# EAGLE design driver_1 (EAGLE 7.2.0)
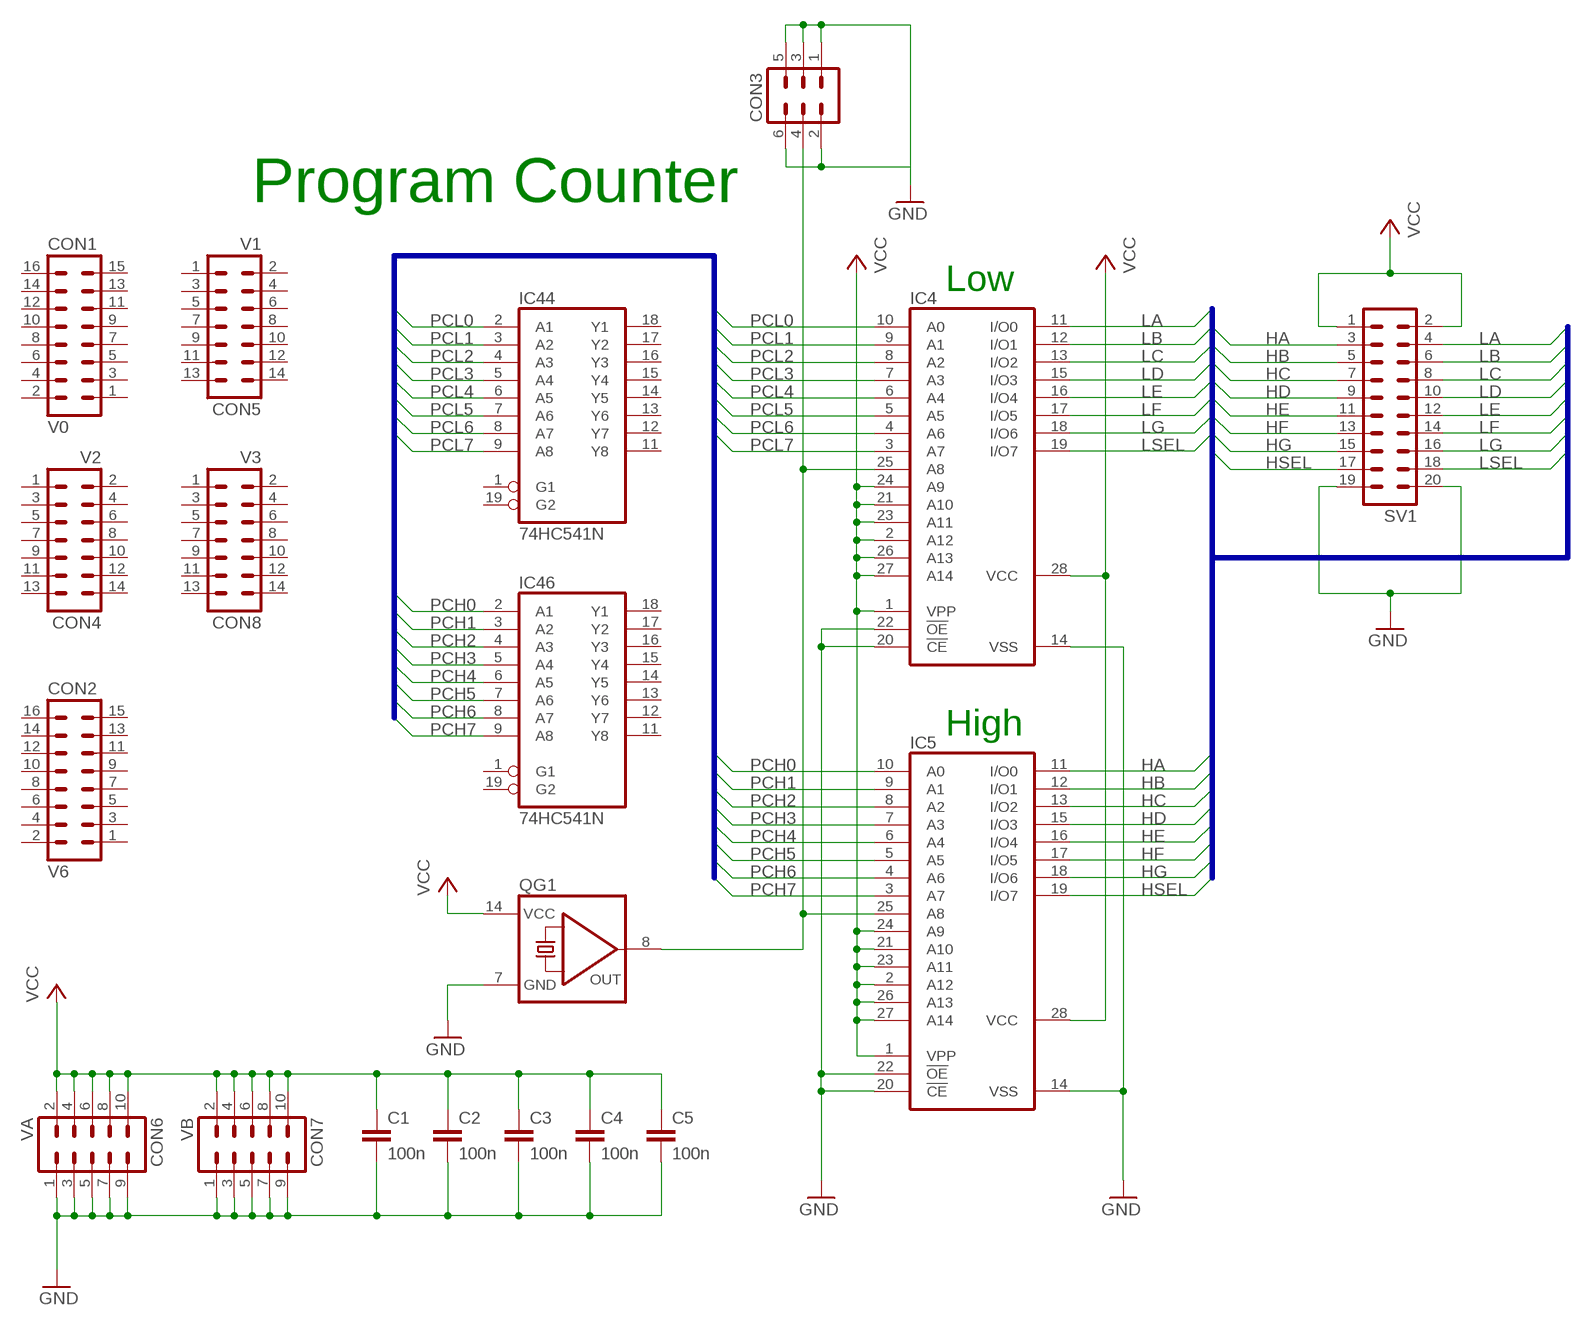
[diagram p0: schematic, sheet 1]

## Parts
C1  100n  C-EU050-024X044  [C050-024X044]
C2  100n  C-EU050-024X044  [C050-024X044]
C3  100n  C-EU050-024X044  [C050-024X044]
C4  100n  C-EU050-024X044  [C050-024X044]
C5  100n  C-EU050-024X044  [C050-024X044]
CON1  V0  ML16  [ML16]
CON2  V6  ML16  [ML16]
CON3  ML6  [ML6]
CON4  V2  ML14  [ML14]
CON5  V1  ML14  [ML14]
CON6  VA  ML10  [ML10]
CON7  VB  ML10  [ML10]
CON8  V3  ML14  [ML14]
IC4  27C256AG  [DIL28-6]
IC5  27C256AG  [DIL28-6]
IC44  74HC541N  [DIL20]
IC46  74HC541N  [DIL20]
QG1  QG5860  [DIL14S]
SV1  ML20L  [ML20L]

## Nets
GND: C1.2 C2.2 C3.2 C4.2 C5.2 CON3.1 CON3.2 CON3.3 CON3.5 CON3.6 CON6.1 CON6.3 CON6.5 CON6.7 CON6.9 CON7.1 CON7.3 CON7.5 CON7.7 CON7.9 IC4.14(VSS) IC4.20(!CE) IC4.22(!OE) IC5.14(VSS) IC5.20(!CE) IC5.22(!OE) QG1.7(GND) SV1.19 SV1.20
HA: IC5.11(I/O0) SV1.3
HB: IC5.12(I/O1) SV1.5
HC: IC5.13(I/O2) SV1.7
HD: IC5.15(I/O3) SV1.9
HE: IC5.16(I/O4) SV1.11
HF: IC5.17(I/O5) SV1.13
HG: IC5.18(I/O6) SV1.15
HSEL: IC5.19(I/O7) SV1.17
LA: IC4.11(I/O0) SV1.4
LB: IC4.12(I/O1) SV1.6
LC: IC4.13(I/O2) SV1.8
LD: IC4.15(I/O3) SV1.10
LE: IC4.16(I/O4) SV1.12
LF: IC4.17(I/O5) SV1.14
LG: IC4.18(I/O6) SV1.16
LSEL: IC4.19(I/O7) SV1.18
N$2: CON3.4 IC4.25(A8) IC5.25(A8) QG1.8(OUT)
PCH0: IC5.10(A0) IC46.2(A1)
PCH1: IC5.9(A1) IC46.3(A2)
PCH2: IC5.8(A2) IC46.4(A3)
PCH3: IC5.7(A3) IC46.5(A4)
PCH4: IC5.6(A4) IC46.6(A5)
PCH5: IC5.5(A5) IC46.7(A6)
PCH6: IC5.4(A6) IC46.8(A7)
PCH7: IC5.3(A7) IC46.9(A8)
PCL0: IC4.10(A0) IC44.2(A1)
PCL1: IC4.9(A1) IC44.3(A2)
PCL2: IC4.8(A2) IC44.4(A3)
PCL3: IC4.7(A3) IC44.5(A4)
PCL4: IC4.6(A4) IC44.6(A5)
PCL5: IC4.5(A5) IC44.7(A6)
PCL6: IC4.4(A6) IC44.8(A7)
PCL7: IC4.3(A7) IC44.9(A8)
VCC: C1.1 C2.1 C3.1 C4.1 C5.1 CON6.2 CON6.4 CON6.6 CON6.8 CON6.10 CON7.2 CON7.4 CON7.6 CON7.8 CON7.10 IC4.1(VPP) IC4.2(A12) IC4.21(A10) IC4.23(A11) IC4.24(A9) IC4.26(A13) IC4.27(A14) IC4.28(VCC) IC5.1(VPP) IC5.2(A12) IC5.21(A10) IC5.23(A11) IC5.24(A9) IC5.26(A13) IC5.27(A14) IC5.28(VCC) QG1.14(VCC) SV1.1 SV1.2
Unconnected: CON1.1 CON1.2 CON1.3 CON1.4 CON1.5 CON1.6 CON1.7 CON1.8 CON1.9 CON1.10 CON1.11 CON1.12 CON1.13 CON1.14 CON1.15 CON1.16 CON2.1 CON2.2 CON2.3 CON2.4 CON2.5 CON2.6 CON2.7 CON2.8 CON2.9 CON2.10 CON2.11 CON2.12 CON2.13 CON2.14 CON2.15 CON2.16 CON4.1 CON4.2 CON4.3 CON4.4 CON4.5 CON4.6 CON4.7 CON4.8 CON4.9 CON4.10 CON4.11 CON4.12 CON4.13 CON4.14 CON5.1 CON5.2 CON5.3 CON5.4 CON5.5 CON5.6 CON5.7 CON5.8 CON5.9 CON5.10 CON5.11 CON5.12 CON5.13 CON5.14 CON8.1 CON8.2 CON8.3 CON8.4 CON8.5 CON8.6 CON8.7 CON8.8 CON8.9 CON8.10 CON8.11 CON8.12 CON8.13 CON8.14 IC44.1(G1) IC44.11(Y8) IC44.12(Y7) IC44.13(Y6) IC44.14(Y5) IC44.15(Y4) IC44.16(Y3) IC44.17(Y2) IC44.18(Y1) IC44.19(G2) IC46.1(G1) IC46.11(Y8) IC46.12(Y7) IC46.13(Y6) IC46.14(Y5) IC46.15(Y4) IC46.16(Y3) IC46.17(Y2) IC46.18(Y1) IC46.19(G2)

## Buses
PCL[0..7],PCH[0..7]
LA,LB,LC,LD,LE,LF,LG,LSEL,HA,HB,HC,HD,HE,HF,HG,HSEL

## Notes on the sheet
- Program Counter
- Low
- High

## Power pins joined to a net without a drawn wire
GND: IC44.10(GND) IC46.10(GND)
VCC: IC44.20(VCC) IC46.20(VCC)

## Library data of the parts
C1-C5 = rcl:C-EU: CAPACITOR, European symbol
CON1 CON2 = con-harting-ml:ML16: HARTING; OC_FARNELL: unknown; OC_NEWARK: unknown
CON3 = con-harting-ml:ML6: HARTING; OC_FARNELL: unknown; OC_NEWARK: unknown
CON4 CON5 CON8 = con-harting-ml:ML14: HARTING; OC_FARNELL: unknown; OC_NEWARK: unknown
CON6 CON7 = con-harting-ml:ML10: HARTING; OC_FARNELL: unknown; OC_NEWARK: unknown
IC4 IC5 = memory-hitachi:27C256AG: MEMORY; OC_FARNELL: unknown; OC_NEWARK: unknown
IC44 IC46 = 74xx-eu:74*541: Octal BUFFER and LINE DRIVER, 3-state
QG1 = crystal:QG5860: CRYSTAL RESONATOR; OC_FARNELL: unknown; OC_NEWARK: unknown
SV1 = con-harting-ml:ML20: HARTING; OC_FARNELL: unknown; OC_NEWARK: unknown

## Board
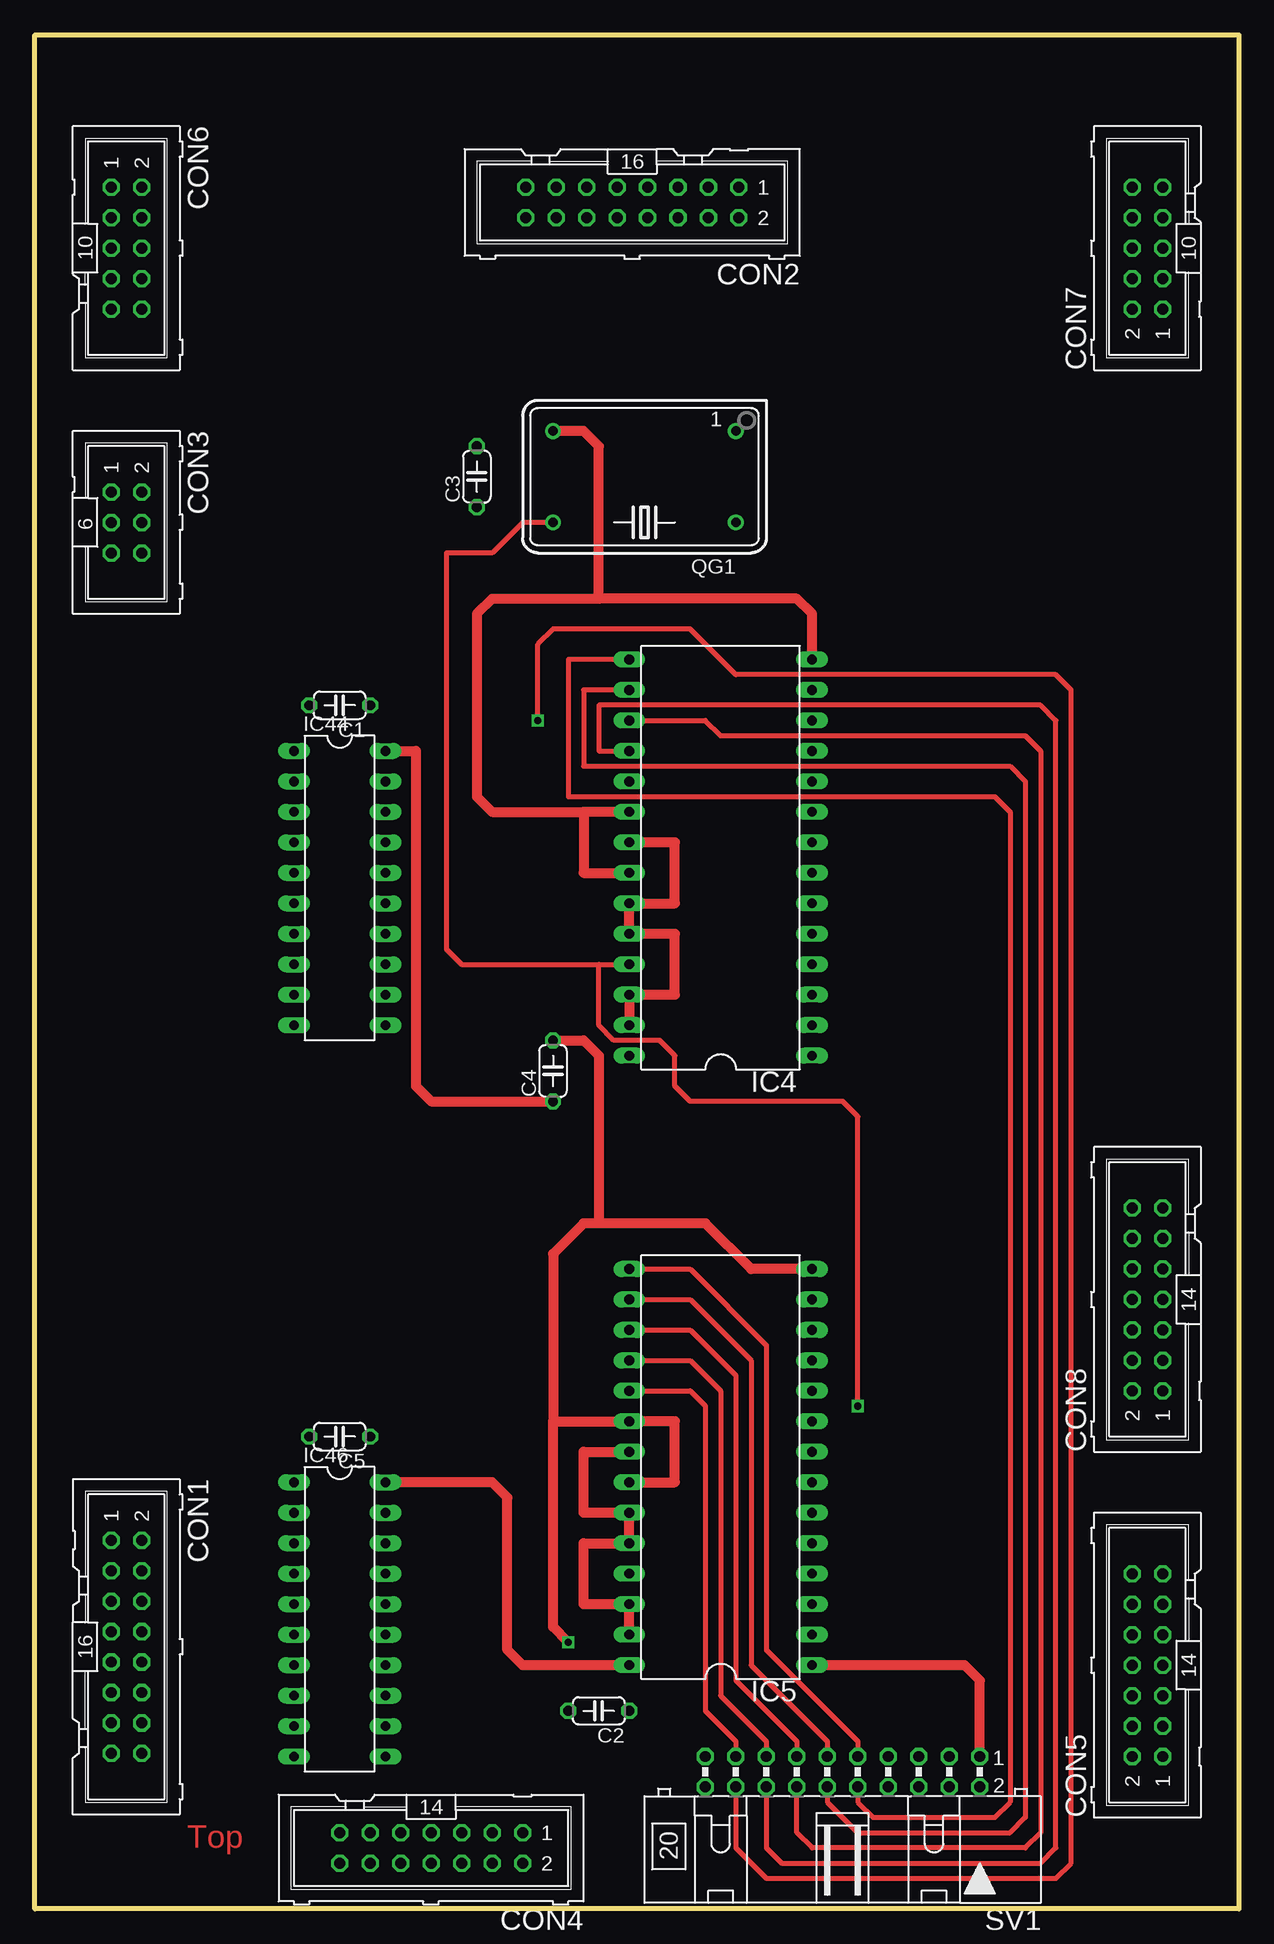
[diagram p1: board, top side]
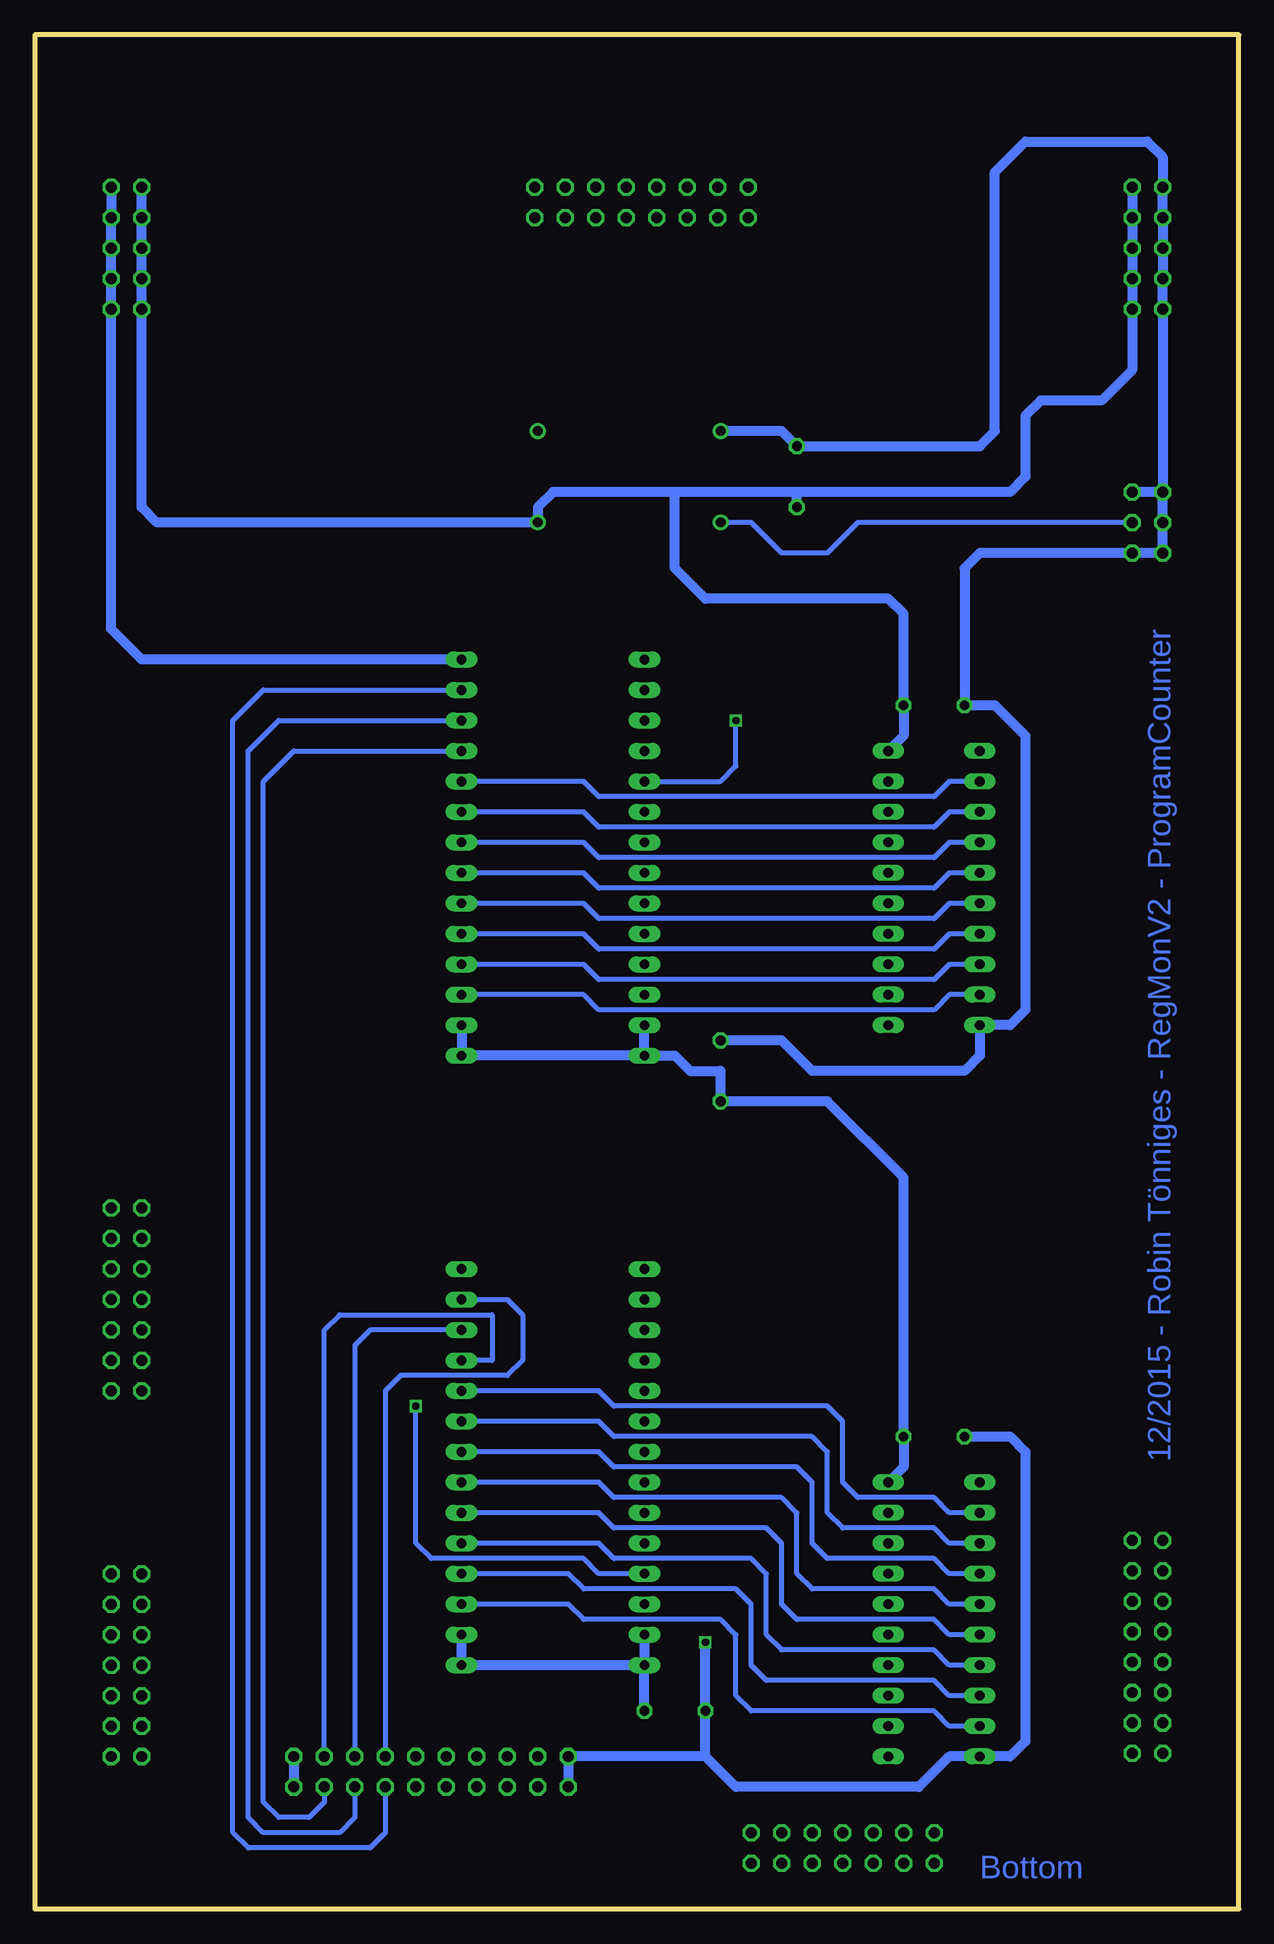
[diagram p2: board, bottom side, seen from below]

Size 100.33 x 156.21 mm. Coordinates in mm from the lower left corner, seen from the top.
Outline: 0,0 0,156.21 100.33,156.21 100.33,0 0,0
Copper layers (1*16): Top 0.035mm / dielectric 1.5mm / Bottom 0.035mm
Design rules "default": minimum track width 10mil, minimum drill 24mil, track to track 10mil, track to pad 20mil, pad to pad 8mil, via to via 8mil, smd to smd 8mil, copper to edge 40mil, drill to drill 8mil, minimum pad ring 10mil, minimum via ring 8mil, stop-mask expansion 4mil, vias tented up to drill 0mil, thermal gap 10mil

### Footprints (pad centres in the part's own frame; a part is rotated, then mirrored left to right if it is on the bottom)
C050-024X044 = drill 0.813 octagon: 1 -2.54,0; 2 2.54,0
ML16 = drill 0.914 octagon: 1 -8.89,-1.27; 2 -8.89,1.27; 3 -6.35,-1.27; 4 -6.35,1.27; 5 -3.81,-1.27; 6 -3.81,1.27; 7 -1.27,-1.27; 8 -1.27,1.27; 9 1.27,-1.27; 10 1.27,1.27; 11 3.81,-1.27; 12 3.81,1.27; 13 6.35,-1.27; 14 6.35,1.27; 15 8.89,-1.27; 16 8.89,1.27
ML6 = drill 0.914 octagon: 1 -2.54,-1.27; 2 -2.54,1.27; 3 0,-1.27; 4 0,1.27; 5 2.54,-1.27; 6 2.54,1.27
ML14 = drill 0.914 octagon: 1 -7.62,-1.27; 2 -7.62,1.27; 3 -5.08,-1.27; 4 -5.08,1.27; 5 -2.54,-1.27; 6 -2.54,1.27; 7 0,-1.27; 8 0,1.27; 9 2.54,-1.27; 10 2.54,1.27; 11 5.08,-1.27; 12 5.08,1.27; 13 7.62,-1.27; 14 7.62,1.27
ML10 = drill 0.914 octagon: 1 -5.08,-1.27; 2 -5.08,1.27; 3 -2.54,-1.27; 4 -2.54,1.27; 5 0,-1.27; 6 0,1.27; 7 2.54,-1.27; 8 2.54,1.27; 9 5.08,-1.27; 10 5.08,1.27
DIL28-6 = drill 0.813 long: 1 -16.51,-7.62; 2 -13.97,-7.62; 3 -11.43,-7.62; 4 -8.89,-7.62; 5 -6.35,-7.62; 6 -3.81,-7.62; 7 -1.27,-7.62; 8 1.27,-7.62; 9 3.81,-7.62; 10 6.35,-7.62; 11 8.89,-7.62; 12 11.43,-7.62; 13 13.97,-7.62; 14 16.51,-7.62; 15 16.51,7.62; 16 13.97,7.62; 17 11.43,7.62; 18 8.89,7.62; 19 6.35,7.62; 20 3.81,7.62; 21 1.27,7.62; 22 -1.27,7.62; 23 -3.81,7.62; 24 -6.35,7.62; 25 -8.89,7.62; 26 -11.43,7.62; 27 -13.97,7.62; 28 -16.51,7.62
DIL20 = drill 0.813 long: 1 -11.43,-3.81; 2 -8.89,-3.81; 3 -6.35,-3.81; 4 -3.81,-3.81; 5 -1.27,-3.81; 6 1.27,-3.81; 7 3.81,-3.81; 8 6.35,-3.81; 9 8.89,-3.81; 10 11.43,-3.81; 11 11.43,3.81; 12 8.89,3.81; 13 6.35,3.81; 14 3.81,3.81; 15 1.27,3.81; 16 -1.27,3.81; 17 -3.81,3.81; 18 -6.35,3.81; 19 -8.89,3.81; 20 -11.43,3.81
DIL14S = drill 0.813: 1 -7.62,-3.81; 7 7.62,-3.81; 8 7.62,3.81; 14 -7.62,3.81
ML20L = drill 0.914 octagon: 1 -11.43,-1.27; 2 -11.43,1.27; 3 -8.89,-1.27; 4 -8.89,1.27; 5 -6.35,-1.27; 6 -6.35,1.27; 7 -3.81,-1.27; 8 -3.81,1.27; 9 -1.27,-1.27; 10 -1.27,1.27; 11 1.27,-1.27; 12 1.27,1.27; 13 3.81,-1.27; 14 3.81,1.27; 15 6.35,-1.27; 16 6.35,1.27; 17 8.89,-1.27; 18 8.89,1.27; 19 11.43,-1.27; 20 11.43,1.27

### Placement (x,y rotation side)
C1  25.4,100.33 180 top
C2  46.99,16.51 180 top
C3  36.83,119.38 90 top
C4  43.18,69.85 90 top
C5  25.4,39.37 180 top
CON1  7.62,21.84 270 top
CON2  49.78,142.24 180 top
CON3  7.62,115.57 270 top
CON4  33.02,5.08 180 top
CON5  92.71,20.32 90 top
CON6  7.62,138.43 270 top
CON7  92.71,138.43 90 top
CON8  92.71,50.8 90 top
IC4  57.15,87.63 90 top
IC5  57.15,36.83 90 top
IC44  25.4,85.09 270 top
IC46  25.4,24.13 270 top
QG1  50.8,119.38 180 top
SV1  67.31,11.43 180 top

### Tracks (layer width: path | path; a pad name or v marks a point on that pad's centre or on a via)
GND  (via drill 0.6)
  Top 0.813: IC4.14 64.77,107.95 63.5,109.22 46.99,109.22 | 45.72,91.44 38.1,91.44 36.83,92.71 36.83,107.95 38.1,109.22 46.99,109.22 | IC5.14 59.69,53.34 55.88,57.15 46.99,57.15 | 46.99,57.15 45.72,57.15 43.18,54.61 43.18,40.64 | 43.18,40.64 IC5.20 53.34,40.64 53.34,35.56 IC5.22 | IC4.20 45.72,91.44 | 45.72,91.44 45.72,86.36 IC4.22 | v44.45,22.23 43.18,23.5 43.18,40.64 | C4.2 45.72,72.39 46.99,71.12 46.99,57.15 | 46.99,109.22 46.99,121.92 45.72,123.19 QG1.7
  Bottom 0.813: CON7.9 CON7.7 CON7.5 CON7.3 CON7.1 93.98,106.68 91.44,104.14 IC4.14 | QG1.7 38.1,123.19 C3.2 21.59,121.92 20.32,123.19 20.32,144.78 17.78,147.32 7.62,147.32 6.35,146.05 CON6.1 CON6.3 CON6.5 CON6.7 CON6.9 CON3.1 | CON3.1 CON3.2 | CON3.1 CON3.3 CON3.5 CON3.6 21.59,113.03 22.86,111.76 C1.2 20.32,100.33 17.78,97.79 17.78,74.93 19.05,73.66 IC44.10 21.59,71.12 22.86,69.85 35.56,69.85 38.1,72.39 C4.2 | C5.2 19.05,39.37 17.78,38.1 17.78,13.97 19.05,12.7 IC46.10 24.13,12.7 26.67,10.16 41.91,10.16 44.45,12.7 | 44.45,12.7 C2.2 v44.45,22.23 | SV1.20 SV1.19 44.45,12.7
HA
  Bottom 0.406: SV1.3 76.2,48.26 74.93,49.53 62.23,49.53 62.23,45.72 IC5.11
HB
  Bottom 0.406: IC5.12 72.39,48.26 73.66,46.99 SV1.5
HC
  Bottom 0.406: IC5.13 60.96,50.8 59.69,49.53 59.69,45.72 60.96,44.45 69.85,44.45 71.12,43.18 SV1.7
HD
  Top 0.406: IC5.15 54.61,53.34 60.96,46.99 60.96,21.59 68.58,13.97 SV1.9
HE
  Top 0.406: IC5.16 54.61,50.8 59.69,45.72 59.69,20.32 66.04,13.97 SV1.11
HF
  Top 0.406: IC5.17 54.61,48.26 58.42,44.45 58.42,19.05 63.5,13.97 SV1.13
HG
  Top 0.406: IC5.18 54.61,45.72 57.15,43.18 57.15,17.78 60.96,13.97 SV1.15
HSEL
  Top 0.406: IC5.19 54.61,43.18 55.88,41.91 55.88,16.51 58.42,13.97 SV1.17
LA
  Bottom 0.406: SV1.4 76.2,8.89 77.47,7.62 80.01,7.62 81.28,8.89 81.28,93.98 78.74,96.52 IC4.11
LB
  Bottom 0.406: SV1.6 73.66,7.62 74.93,6.35 81.28,6.35 82.55,7.62 82.55,96.52 80.01,99.06 IC4.12
LC
  Bottom 0.406: SV1.8 71.12,6.35 72.39,5.08 82.55,5.08 83.82,6.35 83.82,99.06 81.28,101.6 IC4.13
LD
  Top 0.406: SV1.10 68.58,8.89 69.85,7.62 80.01,7.62 81.28,8.89 81.28,91.44 80.01,92.71 44.45,92.71 44.45,104.14 IC4.15
LE
  Top 0.406: SV1.12 66.04,8.89 68.58,6.35 81.28,6.35 82.55,7.62 82.55,93.98 81.28,95.25 45.72,95.25 45.72,101.6 IC4.16
LF
  Top 0.406: IC4.17 55.88,99.06 57.15,97.79 82.55,97.79 83.82,96.52 83.82,6.35 82.55,5.08 64.77,5.08 63.5,6.35 SV1.14
LG
  Top 0.406: SV1.16 60.96,5.08 62.23,3.81 83.82,3.81 85.09,5.08 85.09,99.06 83.82,100.33 46.99,100.33 46.99,96.52 IC4.18
LSEL  (via drill 0.6)
  Top 0.406: SV1.18 58.42,5.08 60.96,2.54 85.09,2.54 86.36,3.81 86.36,101.6 85.09,102.87 58.42,102.87 54.61,106.68 43.18,106.68 41.91,105.41 v41.91,99.06
  Bottom 0.406: IC4.19 43.18,93.98 41.91,95.25 v41.91,99.06
N$1
  Bottom 0.406: 0,0 0,156.21 100.33,156.21 100.33,0 0,0
N$2  (via drill 0.6)
  Top 0.406: QG1.8 40.64,115.57 38.1,113.03 34.29,113.03 34.29,80.01 35.56,78.74 46.99,78.74 | 46.99,78.74 IC4.25 | v68.58,41.91 68.58,66.04 67.31,67.31 54.61,67.31 53.34,68.58 53.34,71.12 52.07,72.39 48.26,72.39 46.99,73.66 46.99,78.74
  Bottom 0.406: CON3.4 31.75,115.57 34.29,113.03 38.1,113.03 40.64,115.57 QG1.8 | IC5.25 53.34,27.94 54.61,29.21 67.31,29.21 68.58,30.48 v68.58,41.91
PCH0
  Bottom 0.406: IC46.2 24.13,33.02 25.4,34.29 31.75,34.29 33.02,35.56 33.02,40.64 34.29,41.91 52.07,41.91 53.34,43.18 IC5.10
PCH1
  Bottom 0.406: IC46.3 24.13,30.48 25.4,31.75 33.02,31.75 34.29,33.02 34.29,38.1 35.56,39.37 52.07,39.37 53.34,40.64 IC5.9
PCH2
  Bottom 0.406: IC46.4 24.13,27.94 25.4,29.21 34.29,29.21 35.56,30.48 35.56,35.56 36.83,36.83 52.07,36.83 53.34,38.1 IC5.8
PCH3
  Bottom 0.406: IC46.5 24.13,25.4 25.4,26.67 35.56,26.67 36.83,27.94 36.83,33.02 38.1,34.29 52.07,34.29 53.34,35.56 IC5.7
PCH4
  Bottom 0.406: IC46.6 24.13,22.86 25.4,24.13 36.83,24.13 38.1,25.4 38.1,30.48 39.37,31.75 52.07,31.75 53.34,33.02 IC5.6
PCH5
  Bottom 0.406: IC46.7 24.13,20.32 25.4,21.59 38.1,21.59 39.37,22.86 39.37,27.94 40.64,29.21 52.07,29.21 53.34,30.48 IC5.5
PCH6
  Bottom 0.406: IC46.8 24.13,17.78 25.4,19.05 39.37,19.05 40.64,20.32 40.64,25.4 41.91,26.67 54.61,26.67 55.88,27.94 IC5.4
PCH7
  Bottom 0.406: IC46.9 24.13,15.24 25.4,16.51 40.64,16.51 41.91,17.78 41.91,22.86 43.18,24.13 54.61,24.13 55.88,25.4 IC5.3
PCL0
  Bottom 0.406: IC44.2 24.13,93.98 25.4,92.71 53.34,92.71 54.61,93.98 IC4.10
PCL1
  Bottom 0.406: IC44.3 24.13,91.44 25.4,90.17 53.34,90.17 54.61,91.44 IC4.9
PCL2
  Bottom 0.406: IC44.4 24.13,88.9 25.4,87.63 53.34,87.63 54.61,88.9 IC4.8
PCL3
  Bottom 0.406: IC44.5 24.13,86.36 25.4,85.09 53.34,85.09 54.61,86.36 IC4.7
PCL4
  Bottom 0.406: IC44.6 24.13,83.82 25.4,82.55 53.34,82.55 54.61,83.82 IC4.6
PCL5
  Bottom 0.406: IC44.7 24.13,81.28 25.4,80.01 53.34,80.01 54.61,81.28 IC4.5
PCL6
  Bottom 0.406: IC44.8 24.13,78.74 25.4,77.47 53.34,77.47 54.61,78.74 IC4.4
PCL7
  Bottom 0.406: IC44.9 24.13,76.2 25.4,74.93 53.34,74.93 54.61,76.2 IC4.3
VCC
  Top 0.813: IC5.28 40.64,20.32 39.37,21.59 39.37,34.29 38.1,35.56 IC46.20 | SV1.1 78.74,19.05 77.47,20.32 IC5.1 | IC44.20 31.75,96.52 31.75,68.58 33.02,67.31 C4.1 | IC5.27 IC5.26 45.72,25.4 45.72,30.48 IC5.24 IC5.23 45.72,33.02 45.72,38.1 IC5.21 | IC4.27 IC4.26 53.34,76.2 53.34,81.28 IC4.24 IC4.23 53.34,83.82 53.34,88.9 IC4.21
  Bottom 0.813: CON7.10 CON7.8 CON7.6 CON7.4 CON7.2 91.44,116.84 90.17,115.57 QG1.14 58.42,116.84 57.15,118.11 46.99,118.11 | CON6.2 CON6.4 CON6.6 CON6.8 CON6.10 8.89,128.27 11.43,125.73 16.51,125.73 17.78,124.46 17.78,119.38 19.05,118.11 36.83,118.11 | C3.1 36.83,118.11 | 36.83,118.11 46.99,118.11 | 46.99,118.11 46.99,111.76 44.45,109.22 29.21,109.22 27.94,107.95 C1.1 27.94,97.79 IC44.20 | IC46.20 27.94,36.83 C5.1 27.94,60.96 34.29,67.31 C4.1 43.18,69.85 45.72,69.85 46.99,71.12 IC4.28 | C2.1 IC5.28 | IC5.28 IC5.1 IC5.2 | SV1.1 SV1.2 | IC4.28 IC4.1 IC4.2 | IC5.27 IC5.28 | IC4.28 IC4.27

### Text on the board
Top: Top
Bottom: 12/2015 - Robin Tönniges - RegMonV2 - ProgramCounter | Bottom